# EAGLE design IPF Remote (EAGLE 9.3.2)
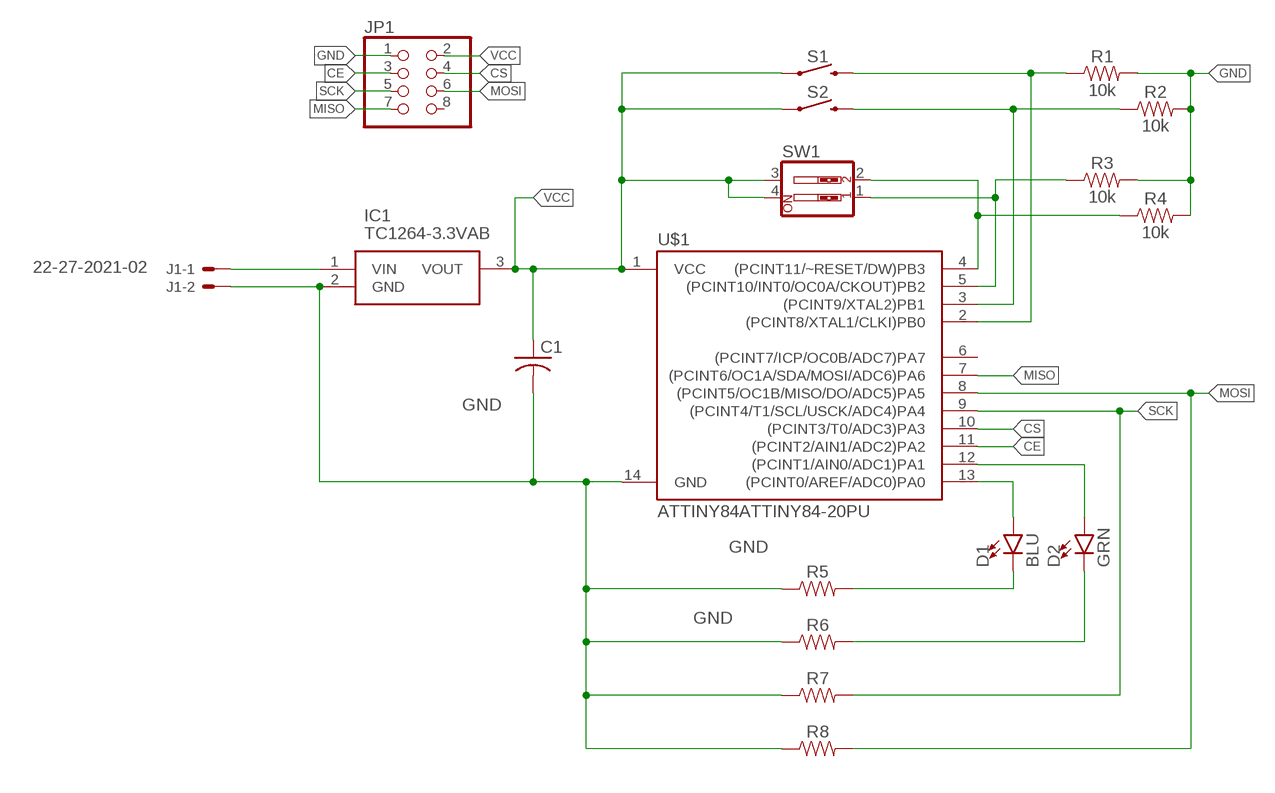
[diagram p0: schematic, sheet 1]

## Parts
C1  C-US025-024X044  [C025-024X044]
D1  BLU  LED3MM  [LED_3MM]
D2  GRN  LED3MM  [LED_3MM]
IC1  TC1264-3.3VAB  [TO254P483X988X2222-3P]
J1  22-27-2021-02  [6410-02]
JP1  PINHD-2X4  [2X04]
R1  10k  10KOHM-HORIZ-1/4W-1%  [AXIAL-0.3]
R2  10k  10KOHM-HORIZ-1/4W-1%  [AXIAL-0.3]
R3  10k  10KOHM-HORIZ-1/4W-1%  [AXIAL-0.3]
R4  10k  10KOHM-HORIZ-1/4W-1%  [AXIAL-0.3]
R5  RESISTORAXIAL-0.3  [AXIAL-0.3]
R6  RESISTORAXIAL-0.3  [AXIAL-0.3]
R7  RESISTORAXIAL-0.3  [AXIAL-0.3]
R8  RESISTORAXIAL-0.3  [AXIAL-0.3]
S1  MOMENTARY-SWITCH-SPST-PTH-6.0MM  [TACTILE_SWITCH_PTH_6.0MM]
S2  MOMENTARY-SWITCH-SPST-PTH-6.0MM  [TACTILE_SWITCH_PTH_6.0MM]
SW1  SW_DIP-2  [EDG-02]
U$1  ATTINY84ATTINY84-20PU  [DIP14]

## Nets
CE: JP1.3 U$1.11((PCINT2/AIN1/ADC2)PA2)
CS: JP1.4 U$1.10((PCINT3/T0/ADC3)PA3)
GND: C1.2 IC1.2(GND) J1.2 JP1.1 R1.P$2 R2.P$2 R3.P$2 R4.P$2 R5.P$1 R6.P$1 R7.P$1 R8.P$1 U$1.14(GND)
MISO: JP1.7 U$1.7((PCINT6/OC1A/SDA/MOSI/ADC6)PA6)
MOSI: JP1.6 R8.P$2 U$1.8((PCINT5/OC1B/MISO/DO/ADC5)PA5)
N$1: IC1.1(VIN) J1.1
N$3: R2.P$1 S2.3 U$1.3((PCINT9/XTAL2)PB1)
N$4: R3.P$1 SW1.1 U$1.5((PCINT10/INT0/OC0A/CKOUT)PB2)
N$5: R4.P$1 SW1.2 U$1.4((PCINT11/~RESET/DW)PB3)
N$6: R1.P$1 S1.3 U$1.2((PCINT8/XTAL1/CLKI)PB0)
N$7: D1.A U$1.13((PCINT0/AREF/ADC0)PA0)
N$8: D2.A U$1.12((PCINT1/AIN0/ADC1)PA1)
N$9: D1.K(C) R5.P$2
N$10: D2.K(C) R6.P$2
SCK: JP1.5 R7.P$2 U$1.9((PCINT4/T1/SCL/USCK/ADC4)PA4)
VCC: C1.1 IC1.3(VOUT) JP1.2 S1.1 S2.1 SW1.3 SW1.4 U$1.1(VCC)
Unconnected: JP1.8 U$1.6((PCINT7/ICP/OC0B/ADC7)PA7)

## Library data of the parts
C1 = adafruit:C-US: CAPACITOR, American symbol
D1 D2 = SparkFun-LED:LED: LED (Generic) Standard schematic elements and footprints for 5mm, 3mm, 1206, and 0603 sized LEDs. Generic LEDs with no color specified.; PROD_ID: DIO-08794
IC1 = TC1264-3.3VAB:TC1264-3.3VAB: LDO Regulator 3.3V 800mA Shutdown TO220 Microchip TC1264-3.3VAB, LDO Voltage Regulator, 800mA, 3.3 V 0.5%, 2.7 6 Vin, 3-Pin TO-220 Source: Datasheet <http://uk.rs-online.com/web/p/products/7747655>; ALLIED_NUMBER: 70414997; ALLIED_PRICE-STOCK: https://www.alliedelec.com/microchip-technology-inc-tc1264-3-3vab/70414997/; DESCRIPTION: LDO Regulator 3.3V 800mA Shutdown TO220 Microchip TC1264-3.3VAB, LDO Voltage Regulator, 800mA, 3.3 V 0.5%, 2.7 6 Vin, 3-Pin TO-220; HEIGHT: 4.826mm; MANUFACTURER_NAME: Microchip; MANUFACTURER_PART_NUMBER: TC1264-3.3VAB; MOUSER_PART_NUMBER: 579-TC1264-3.3VAB; MOUSER_PRICE-STOCK: https://www.mouser.com/Search/Refine.aspx?Keyword=579-TC1264-3.3VAB; RS_PART_NUMBER: 7747655P; RS_PRICE-STOCK: http://uk.rs-online.com/web/p/products/7747655P
J1 = con-molex:22-?-02: CONNECTOR wire to board 2.54 mm (.1 inch) pitch header; MF: MOLEX; OC_FARNELL: unknown; OC_NEWARK: unknown
JP1 = adafruit:PINHD-2X4: PIN HEADER
R1-R4 = SparkFun-Resistors:10KOHM: 10kΩ resistor A resistor is a passive two-terminal electrical component that implements electrical resistance as a circuit element. Resistors act to reduce current flow, and, at the same time, act to lower voltage levels within circuits. - Wikipedia; PROD_ID: RES-12183
R5-R8 = SparkFun-Resistors:RESISTOR: Generic Resistor Package
S1 S2 = SparkFun-Switches:MOMENTARY-SWITCH-SPST: Momentary Switch (Pushbutton) - SPST Normally-open (NO) SPST momentary switches (buttons, pushbuttons). Variants PTH-12MM - 12mm square, through-hole Momentary Pushbutton Switch - 12mm Square <https://www.sparkfun.com/products/9190> (COM-09190) PTH-6.0MM, PTH-6.0MM-KIT - 6.0mm square, through-hole Mini Pushbutton Switch <https://www.sparkfun.com/products/97> (COM-00097) KIT package intended for soldering kit's - only one side of pads' copper is exposed. PTH-RIGHT-ANGLE-KIT - Right-angle, through-hole Right Angle Tactile Button <https://www.sparkfun.com/products/10791> - Used on SparkFun BigTime Watch Kit <https://www.sparkfun.com/products/11734> SMD-12MM - 12mm square, surface-mount Tactile Button - SMD (12mm) <https://www.sparkfun.com/products/12993> (COM-12993) Used on SparkFun PicoBoard <https://www.sparkfun.com/products/11888> SMD-4.5MM - 4.5mm Square Trackball Switch Used on SparkFun Blackberry Trackballer Breakout <https://www.sparkfun.com/products/13169> SMD-4.6MMX2.8MM - 4.60mm x 2.80mm, surface mount Used on SparkFun SAMD21 Mini Breakout <https://www.sparkfun.com/products/13664> SMD-5.2MM, SMD-5.2-REDUNDANT - 5.2mm square, surface-mount Mini Pushbutton Switch - SMD <https://www.sparkfun.com/products/8720> (COM-08720) Used on Arduino Pro Mini <https://www.sparkfun.com/products/11114> REDUNDANT package connects both switch circuits together SMD-6.0X3.5MM - 6.0 x 3.5mm, surface mount Momentary Reset Switch SMD <https://www.sparkfun.com/products/8229> (COM-08229) SMD-6.2MM-TALL - 6.2mm square, surface mount Tactile Button - SMD (6mm) <https://www.sparkfun.com/products/12992> Used on SparkFun Digital Sandbox <https://www.sparkfun.com/products/12651> SMD-RIGHT-ANGLE - Right-angle, surface mount Used on SparkFun Block for Intel® Edison - Arduino <https://www.sparkfun.com/products/13036>; PROD_ID: SWCH-08441; SF_SKU: COM-00097
SW1 = special:SW_DIP-2: DIP SWITCH
U$1 = SparkFun-IC-Microcontroller:ATTINY84: Atmel 14-pin 2/4/8kB flash uC Datasheet <https://cdn.sparkfun.com/datasheets/Widgets/doc8006.pdf> SparkFun Products Tiny AVR Programmer <https://www.sparkfun.com/products/11801> (PGM-11801) SparkFun Servo Trigger - Continuous Rotation <https://www.sparkfun.com/products/13872> (WIG-13872) SparkFun Servo Trigger <https://www.sparkfun.com/products/13118> (WIG-13118)

## Board
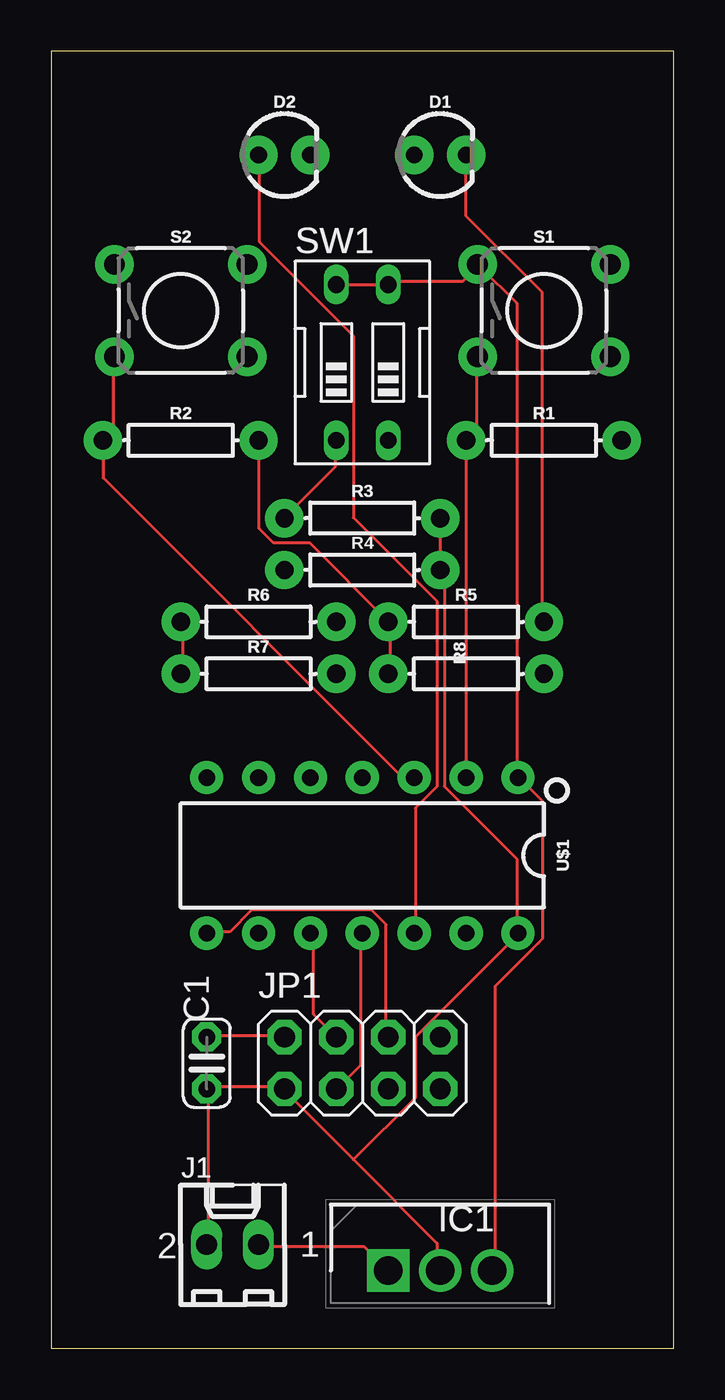
[diagram p1: board, top side]
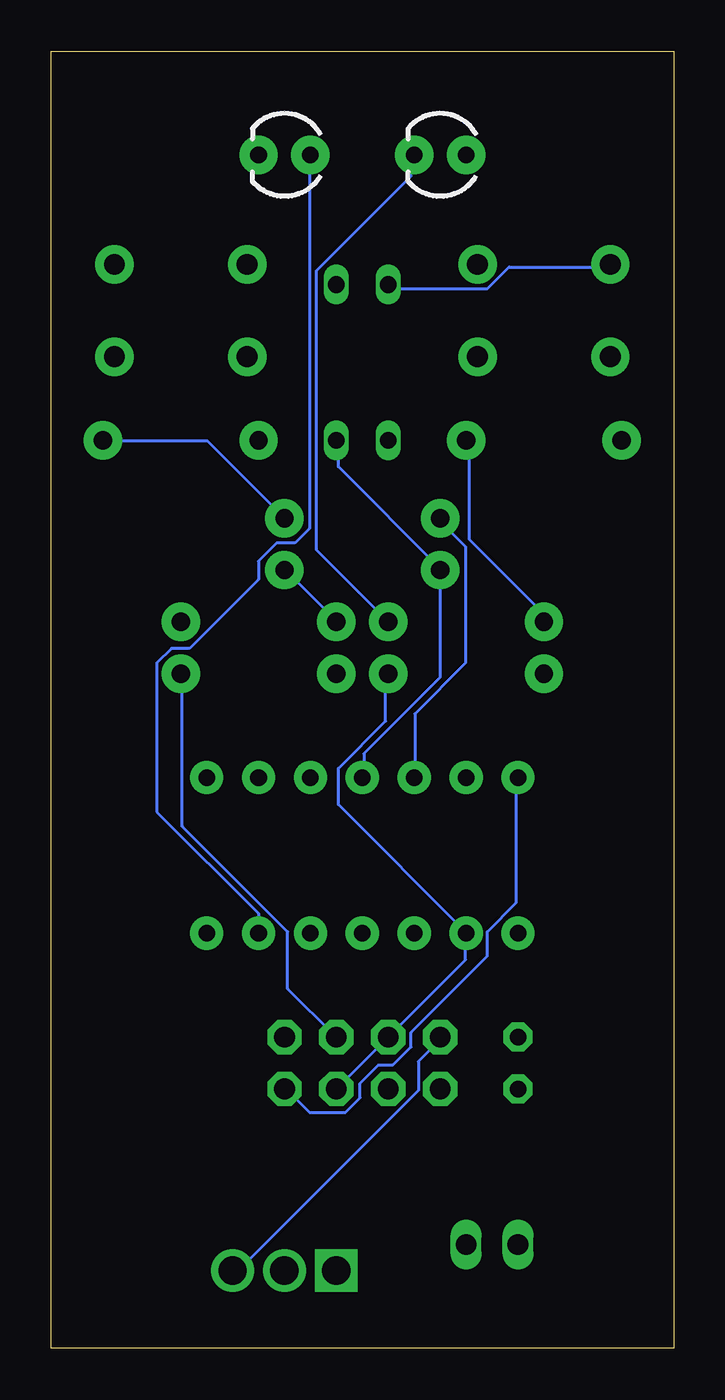
[diagram p2: board, bottom side, seen from below]

Size 30.48 x 63.5 mm. Coordinates in mm from the lower left corner, seen from the top.
Outline: 0,0 30.48,0 30.48,63.5 0,63.5 0,0
Copper layers (1*16): Top 0.035mm / dielectric 1.5mm / Bottom 0.035mm
Design rules "Breadboard_Killer_Design_Rules_Eagle *": minimum track width 6mil, minimum drill 12mil, track to track 8mil, track to pad 6mil, pad to pad 6mil, via to via 6mil, smd to smd 6mil, copper to edge 15mil, drill to drill 8mil, minimum pad ring 8mil, minimum via ring 8mil, stop-mask expansion 4mil, vias tented up to drill 0mil, thermal gap 10mil

### Footprints (pad centres in the part's own frame; a part is rotated, then mirrored left to right if it is on the bottom)
C025-024X044 = drill 0.813 pad 1.422 octagon: 1 -1.27,0; 2 1.27,0
LED_3MM = drill 0.813 pad 1.88: A -1.27,0; K 1.27,0
TO254P483X988X2222-3P = drill 1.39 pad 2.085 square: 1 0,0 | drill 1.39 pad 2.085: 2 2.54,0; 3 5.08,0
6410-02 = drill 1.016 long: 1 1.27,0; 2 -1.27,0
2X04 = drill 1.016 pad 1.676 octagon: 1 -3.81,-1.27; 2 -3.81,1.27; 3 -1.27,-1.27; 4 -1.27,1.27; 5 1.27,-1.27; 6 1.27,1.27; 7 3.81,-1.27; 8 3.81,1.27
AXIAL-0.3 = drill 0.9 pad 1.88: P$1 -3.81,0; P$2 3.81,0
TACTILE_SWITCH_PTH_6.0MM = drill 1.016 pad 1.88: 1 -3.251,2.261; 2 3.251,2.261; 3 -3.251,-2.261; 4 3.251,-2.261
EDG-02 = drill 0.813 long: 1 -1.27,-3.81; 2 1.27,-3.81; 3 1.27,3.81; 4 -1.27,3.81
DIP14 = drill 0.813 pad 1.626: 1 -7.62,-3.81; 2 -5.08,-3.81; 3 -2.54,-3.81; 4 0,-3.81; 5 2.54,-3.81; 6 5.08,-3.81; 7 7.62,-3.81; 8 7.62,3.81; 9 5.08,3.81; 10 2.54,3.81; 11 0,3.81; 12 -2.54,3.81; 13 -5.08,3.81; 14 -7.62,3.81

### Placement (x,y rotation side)
C1  7.62,13.97 270 top
D1  19.05,58.42 0 top
D2  11.43,58.42 0 top
IC1  16.51,3.81 0 top
J1  8.89,5.08 0 top
JP1  15.24,13.97 0 top
R1  24.13,44.45 0 top
R2  6.35,44.45 0 top
R3  15.24,40.64 0 top
R4  15.24,38.1 0 top
R5  20.32,35.56 0 top
R6  10.16,35.56 0 top
R7  10.16,33.02 0 top
R8  20.32,33.02 0 top
S1  24.13,50.8 0 top
S2  6.35,50.8 0 top
SW1  15.24,48.26 0 top
U$1  15.24,24.13 180 top

### Tracks (layer width: path | path; a pad name or v marks a point on that pad's centre or on a via)
CE
  Top 0.152: U$1.11 15.16,20.22 15.16,13.87 14.1,12.8 JP1.3
CS
  Top 0.152: JP1.4 12.85,16.36 12.85,20.22 U$1.10
GND
  Top 0.152: J1.2 7.7,5.16 7.7,12.62 C1.2 7.7,12.8 11.43,12.8 JP1.1 11.43,12.62 14.81,9.25 | 14.81,9.25 18.9,5.16 18.9,3.91 IC1.2 | R7.P$1 6.45,33.02 6.45,35.51 R6.P$1 | R8.P$1 16.59,33.02 16.59,35.51 R5.P$1 16.41,35.69 12.68,39.42 10.9,39.42 10.19,40.13 10.19,44.4 R2.P$2 | R3.P$2 19.07,40.49 19.07,38.18 R4.P$2 19.07,38 19.25,37.82 19.25,27.51 22.81,23.95 22.81,20.4 U$1.14 22.81,20.22 17.83,15.24 17.83,12.27 14.81,9.25
  Bottom 0.152: R2.P$2 10.01,44.4 10.01,39.6 6.45,36.04 6.45,35.69 R6.P$1 | R3.P$2 22.81,44.4 27.79,44.4 R1.P$2 | R5.P$1 16.59,35.69 18.9,38 R4.P$2
MISO
  Bottom 0.152: U$1.7 7.7,27.86 7.7,21.82 9.12,20.4 9.12,19.2 12.85,15.47 12.85,14.76 13.74,13.87 14.45,13.87 15.34,12.98 15.34,12.27 16.05,11.56 17.83,11.56 18.9,12.62 JP1.7
MOSI
  Top 0.152: U$1.8 7.7,20.4 8.76,20.4 9.83,21.46 15.7,21.46 16.41,20.75 16.41,15.29 JP1.6
  Bottom 0.152: R8.P$2 24.05,33.02 24.05,25.55 18.9,20.4 18.9,17.6 16.59,15.29 JP1.6
N$1
  Top 0.152: IC1.1 15.34,4.98 10.19,4.98 J1.1
N$3
  Top 0.152: U$1.3 17.65,28.04 17.12,28.04 2.54,42.62 R2.P$1 2.54,44.58 3.07,45.11 3.07,48.49 S2.3
N$4
  Top 0.152: SW1.1 13.92,44.4 13.92,43.16 11.43,40.66 R3.P$1
  Bottom 0.152: U$1.5 12.68,28.04 12.68,31.06 10.19,33.55 10.19,39.24 11.43,40.49 R3.P$1
N$5
  Bottom 0.152: SW1.2 16.41,44.4 16.41,43.16 11.43,38.18 R4.P$1 11.43,32.84 15.16,29.11 15.16,28.04 U$1.4
N$6
  Top 0.152: U$1.2 R1.P$1 20.32,44.58 20.85,45.11 20.85,48.49 S1.3
N$7
  Bottom 0.152: U$1.13 20.32,21.29 25.3,26.26 25.3,33.55 24.59,34.27 23.7,34.27 20.32,37.64 20.32,38.53 19.43,39.42 18.54,39.42 17.83,40.13 17.83,58.27 D1.A
N$8
  Top 0.152: U$1.12 17.83,20.4 17.83,26.44 18.9,27.51 18.9,36.58 14.81,40.66 14.81,49.55 10.19,54.18 10.19,58.27 D2.A
N$9
  Top 0.152: D1.K 20.32,55.42 24.05,51.69 24.05,35.69 R5.P$2
N$10
  Bottom 0.152: R6.P$2 17.48,39.06 17.48,52.76 12.85,57.38 12.85,58.27 D2.K
SCK
  Bottom 0.152: JP1.5 10.19,19.02 10.19,20.3 U$1.9 10.19,20.4 16.41,26.62 16.41,28.4 14.1,30.71 14.1,33.02 R7.P$2
VCC
  Top 0.152: C1.1 7.7,15.29 11.43,15.29 JP1.2 | SW1.4 14.1,52.05 16.41,52.05 SW1.3 16.59,52.22 20.14,52.22 20.85,52.93 S1.1 21.03,52.93 22.81,51.16 22.81,28.04 U$1.1 22.99,27.86 24.05,26.8 24.05,20.04 21.74,17.73 21.74,3.91 IC1.3
  Bottom 0.152: IC1.3 21.57,3.91 21.21,3.91 12.5,12.62 12.5,14.05 11.43,15.11 JP1.2 | S2.1 3.25,52.93 8.05,52.93 9.12,51.87 13.74,51.87 13.92,52.05 SW1.4

### Text on the board
_tNames: D2 | D2 | D1 | D1 | S2 | S2 | SW1 | SW1 | S1 | S1 | R2 | R2 | R1 | R1 | R3 | R3 | R4 | R6 | R6 | R5 | R5 | R7 | R7 | R8 | R8 | U$1 | U$1 | JP1 | JP1 | J1 | J1 | IC1 | IC1